# Altium project CamBienMau.PrjPcb
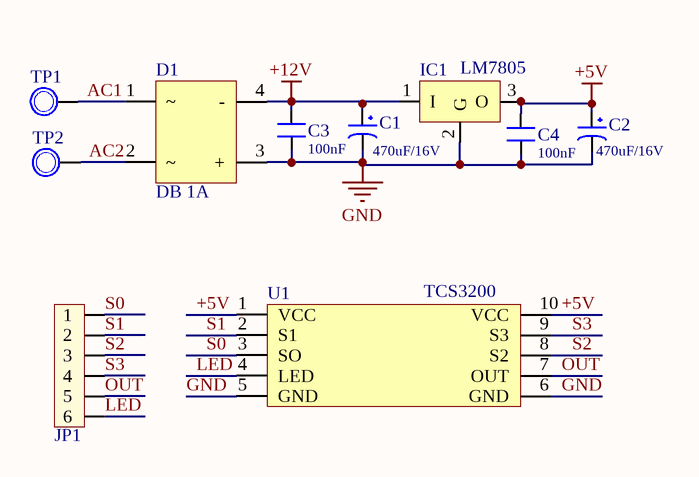
[diagram p0: CamBienMau.SchDoc]
1 sheet, 10 parts. Net scope: global (net labels, ports and power ports of the same name join across sheets).
Board file: CamBienMau.PcbDoc

## Sheet CamBienMau.SchDoc
size A4

### Parts
C1  470uF/16V  [C-TANT-7343]
C2  470uF/16V  [C-TANT-7343]
C3  100nF  [CER-0805]
C4  100nF  [CER-0805]
D1  DB 1A  [D-DB-1A-SMD]
IC1  LM7805  [TO252-123]
JP1  JP6 PIN  [JP6]  (value not drawn)
TP1  TP  [TP]  (value not drawn)
TP2  TP  [TP]  (value not drawn)
U1  TCS3200

### Nets
+5V: C2.1 C4.2 IC1.3(O) U1.1(VCC) U1.10(VCC)
+12V: C1.1 C3.2 D1.4(-) IC1.1(I)
GND: C1.2 C2.2 C3.1 C4.1 D1.3(+) IC1.2(G) U1.5(GND) U1.6(GND)
AC1: D1.1 TP1.1
AC2: D1.2 TP2.1
LED: JP1.6 U1.4(LED)
OUT: JP1.5 U1.7(OUT)
S0: JP1.1 U1.3(SO)
S1: JP1.2 U1.2(S1)
S2: JP1.3 U1.8(S2)
S3: JP1.4 U1.9(S3)

### Library data of the parts
C1 C2 = Capacitor
C3 C4 = Ceramic
D1 = DB
IC1 = LM78xx: Positive Voltage Regulator; Note: Tab is connected to pin 3 (GND).; Published: 24-Aug-2001; LatestRevisionDate: 17-Jul-2002; LatestRevisionNote: Re-released for DXP Platform.; DatasheetVersion: Apr-1994; PackageVersion: Jul-1998; PackageReference: ISOWATT220AB; Publisher: Altium Limited; PackageDescription: TO, Thru-Hole, Vertical, Heatsink Mounted; 3 In-Line Leads; Pitch 2.54 mm; Pin sequence 1, 3, 2; ComponentLink1Description: Manufacturer Link; ComponentLink1URL: http://www.st.com/; ComponentLink2Description: Datasheet; ComponentLink2URL: http://www.st.com/stonline/products/literature/ds/2146/l78m05c.pdf
JP1 = JP6: Value: JP7